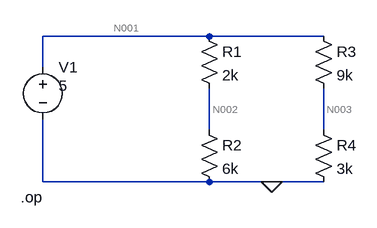
[diagram p0: schematic Draft1.asc]
Draft1.asc, the LTspice schematic file:
Version 4
SHEET 1 880 680
WIRE 160 112 -96 112
WIRE 336 112 160 112
WIRE -96 160 -96 112
WIRE 160 256 160 192
WIRE 336 256 336 192
WIRE -96 336 -96 240
WIRE 160 336 -96 336
WIRE 256 336 160 336
WIRE 336 336 256 336
FLAG 256 336 0
SYMBOL res 144 96 R0
SYMATTR InstName R1
SYMATTR Value 2k
SYMBOL res 144 240 R0
SYMATTR InstName R2
SYMATTR Value 6k
SYMBOL res 320 96 R0
SYMATTR InstName R3
SYMATTR Value 9k
SYMBOL res 320 240 R0
SYMATTR InstName R4
SYMATTR Value 3k
SYMBOL voltage -96 144 R0
WINDOW 3 24 44 Left 2
WINDOW 123 0 0 Left 0
WINDOW 39 0 0 Left 0
SYMATTR InstName V1
SYMATTR Value 5
TEXT -130 360 Left 2 !.op

The netlist it stands for:
* Draft1.asc
R1 N001 N002 2k
R2 N002 0 6k
R3 N001 N003 9k
R4 N003 0 3k
V1 N001 0 5
.op
.backanno
.end

* Results of the author's LTspice run, read from the files saved beside the schematic
* Operating Point:
*   V(n001) = 5 V
*   V(n002) = 3.75 V
*   V(n003) = 1.25 V
*   I(R4) = 416.7 µA
*   I(R3) = 416.7 µA
*   I(R2) = 625 µA
*   I(R1) = 625 µA
*   I(V1) = -1.042 mA